# Altium schematic sheet PROTECTION_BUS_CAN.SchDoc
size A4
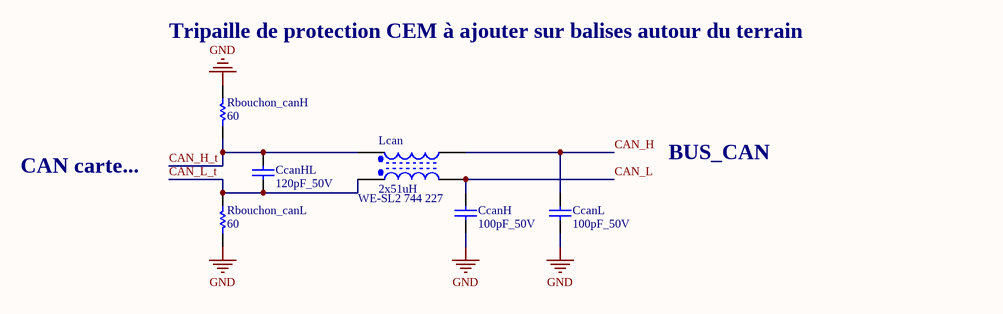
[diagram p0: PROTECTION_BUS_CAN.SchDoc]

## Parts
CcanH  100pF_50V  [C0805_N]
CcanHL  120pF_50V  [C0805_N]
CcanL  100pF_50V  [C0805_N]
Lcan  2x51uH  Manufacturer Part Number: WE-SL2 744 227  [Self de mode commun Wurth Elektronik WE-SL2]
Rbouchon_canH  60  [R1206_N]
Rbouchon_canL  60  [R1206_N]

## Nets
GND: CcanH.1 CcanL.1 Rbouchon_canH.2 Rbouchon_canL.1
CAN_H: CcanL.2 Lcan.3
CAN_H_t: CcanHL.2 Lcan.2 Rbouchon_canH.1
CAN_L: CcanH.2 Lcan.4
CAN_L_t: CcanHL.1 Lcan.1 Rbouchon_canL.2

## Notes on the sheet
- Tripaille de protection CEM à ajouter sur balises autour du terrain
- CAN carte...
- BUS_CAN

## Library data of the parts
CcanH CcanL = Capacitor: FAR: 722080; Published: 8-Jun-2000; LatestRevisionDate: 17-Jul-2002; LatestRevisionNote: Re-released for DXP Platform.; PackageReference: RAD-0.3; Publisher: Altium Limited
CcanHL = Capacitor: FAR: 722042; Published: 8-Jun-2000; LatestRevisionDate: 17-Jul-2002; LatestRevisionNote: Re-released for DXP Platform.; PackageReference: RAD-0.3; Publisher: Altium Limited
Lcan = Self de mode commun WE-744220: Self de mode commun, Wurth Elektronik, WE-SL2; Inductance: 4.7; DC Current Rating: 500; Max DC Resistance: 0.75; Core Material: Ferrite; Inductor Case Style: 74422; Tolérance d'inductance: ± 50%; Description: WUERTH ELEKTRONIK - WE-SL2 744 227 - FILTRE DE LIGNE MODE COMMUN CMS 2X51uH; FAR: 1636267; RoHS: YES; Série: WE-SL2; Category: Composants passifs; ComponentLink1URL: http://www.farnell.com/datasheets/70375.pdf; ComponentLink1Description: http://www.farnell.com/datasheets/70375.pdf; Pricing: 1=2,1, 10=1,95, 50=1,8, 100=1,69, 250=1,59 (EUR); Manufacturer: WURTH ELEKTRONIK
Rbouchon_canH Rbouchon_canL = Resistor: FAR: 1652832